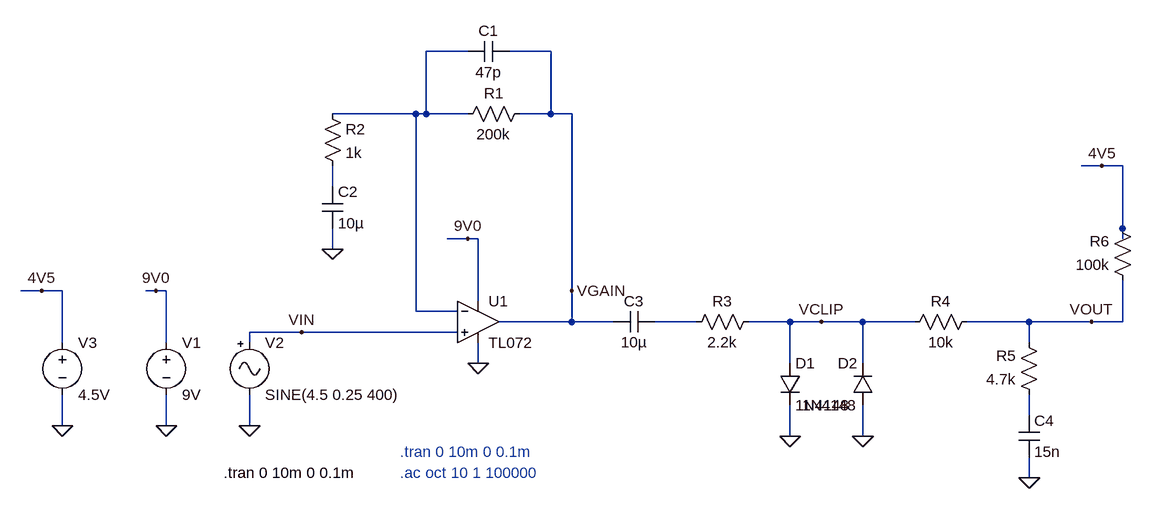
[diagram p0: schematic distortion_stage.asc]
distortion_stage.asc, the LTspice schematic file:
Version 4
SHEET 1 1476 680
WIRE 448 -96 384 -96
WIRE 576 -96 512 -96
WIRE 368 0 240 0
WIRE 384 0 384 -96
WIRE 384 0 368 0
WIRE 448 0 384 0
WIRE 576 0 576 -96
WIRE 576 0 528 0
WIRE 608 0 576 0
WIRE 1424 80 1392 80
WIRE 1456 80 1424 80
WIRE 240 112 240 80
WIRE 1456 176 1456 80
WIRE 448 192 416 192
WIRE 464 192 448 192
WIRE 1456 192 1456 176
WIRE 240 208 240 176
WIRE -208 272 -240 272
WIRE -176 272 -208 272
WIRE -32 272 -48 272
WIRE -16 272 -32 272
WIRE 608 272 608 0
WIRE 464 288 464 192
WIRE 368 304 368 0
WIRE 432 304 368 304
WIRE 608 320 608 272
WIRE 608 320 496 320
WIRE 672 320 608 320
WIRE 800 320 736 320
WIRE 944 320 880 320
WIRE 992 320 944 320
WIRE 1056 320 992 320
WIRE 1136 320 1056 320
WIRE 1312 320 1216 320
WIRE 1408 320 1312 320
WIRE 1456 320 1456 256
WIRE 1456 320 1408 320
WIRE 192 336 112 336
WIRE 432 336 192 336
WIRE -176 352 -176 272
WIRE -16 352 -16 272
WIRE 112 352 112 336
WIRE 1312 352 1312 320
WIRE 464 384 464 352
WIRE 944 384 944 320
WIRE 1056 384 1056 320
WIRE 1312 464 1312 432
WIRE -176 480 -176 432
WIRE -16 480 -16 432
WIRE 112 480 112 432
WIRE 944 496 944 448
WIRE 1056 496 1056 448
WIRE 1312 560 1312 528
FLAG -16 480 0
FLAG 112 480 0
FLAG 464 384 0
FLAG -32 272 9V0
FLAG 448 192 9V0
FLAG 192 336 VIN
FLAG 608 272 VGAIN
FLAG 240 208 0
FLAG -176 480 0
FLAG -208 272 4V5
FLAG 1424 80 4V5
FLAG 1312 560 0
FLAG 1408 320 VOUT
FLAG 992 320 VCLIP
FLAG 944 496 0
FLAG 1056 496 0
SYMBOL voltage -16 336 R0
SYMATTR InstName V1
SYMATTR Value 9V
SYMBOL Misc/signal 112 336 R0
SYMATTR InstName V2
SYMATTR Value SINE(4.5 0.25 400)
SYMATTR Value2 AC 1 0
SYMBOL Opamps/TL072 464 256 R0
SYMATTR InstName U1
SYMBOL res 544 -16 R90
WINDOW 0 0 56 VBottom 2
WINDOW 3 32 56 VTop 2
SYMATTR InstName R1
SYMATTR Value 200k
SYMBOL res 224 -16 R0
SYMATTR InstName R2
SYMATTR Value 1k
SYMBOL cap 512 -112 R90
WINDOW 0 0 32 VBottom 2
WINDOW 3 32 32 VTop 2
SYMATTR InstName C1
SYMATTR Value 47p
SYMBOL cap 224 112 R0
SYMATTR InstName C2
SYMATTR Value 10µ
SYMBOL cap 736 304 R90
WINDOW 0 0 32 VBottom 2
WINDOW 3 32 32 VTop 2
SYMATTR InstName C3
SYMATTR Value 10µ
SYMBOL res 896 304 R90
WINDOW 0 0 56 VBottom 2
WINDOW 3 32 56 VTop 2
SYMATTR InstName R3
SYMATTR Value 2.2k
SYMBOL res 1232 304 R90
WINDOW 0 0 56 VBottom 2
WINDOW 3 32 56 VTop 2
SYMATTR InstName R4
SYMATTR Value 10k
SYMBOL res 1328 448 R180
WINDOW 0 36 76 Left 2
WINDOW 3 36 40 Left 2
SYMATTR InstName R5
SYMATTR Value 4.7k
SYMBOL res 1472 272 R180
WINDOW 0 36 76 Left 2
WINDOW 3 36 40 Left 2
SYMATTR InstName R6
SYMATTR Value 100k
SYMBOL voltage -176 336 R0
SYMATTR InstName V3
SYMATTR Value 4.5V
SYMBOL cap 1296 464 R0
SYMATTR InstName C4
SYMATTR Value 15n
SYMBOL diode 928 384 R0
SYMATTR InstName D1
SYMATTR Value 1N4148
SYMBOL diode 1072 448 R180
WINDOW 0 24 64 Left 2
WINDOW 3 24 0 Left 2
SYMATTR InstName D2
SYMATTR Value 1N4148
TEXT 72 552 Left 2 !.tran 0 10m 0 0.1m
TEXT 344 520 Left 2 ;.tran 0 10m 0 0.1m
TEXT 344 552 Left 2 ;.ac oct 10 1 100000

The netlist it stands for:
* distortion_stage.asc
V1 9V0 0 9V
V2 VIN 0 SINE(4.5 0.25 400) AC 1 0
XU1 VIN N001 9V0 0 VGAIN TL072  ; pins In+ In- V+ V- OUT
R1 VGAIN N001 200k
R2 N001 N002 1k
C1 VGAIN N001 47p
C2 N002 0 10µ
C3 N003 VGAIN 10µ
R3 VCLIP N003 2.2k
R4 VOUT VCLIP 10k
R5 N004 VOUT 4.7k
R6 VOUT 4V5 100k
V3 4V5 0 4.5V
C4 N004 0 15n
D1 VCLIP 0 1N4148
D2 0 VCLIP 1N4148
.model D D
.lib standard.dio
.tran 0 10m 0 0.1m
* .tran 0 10m 0 0.1m
* .ac oct 10 1 100000
.backanno
.end